# EAGLE design EKG_Modul_I (EAGLE 9.3.1)
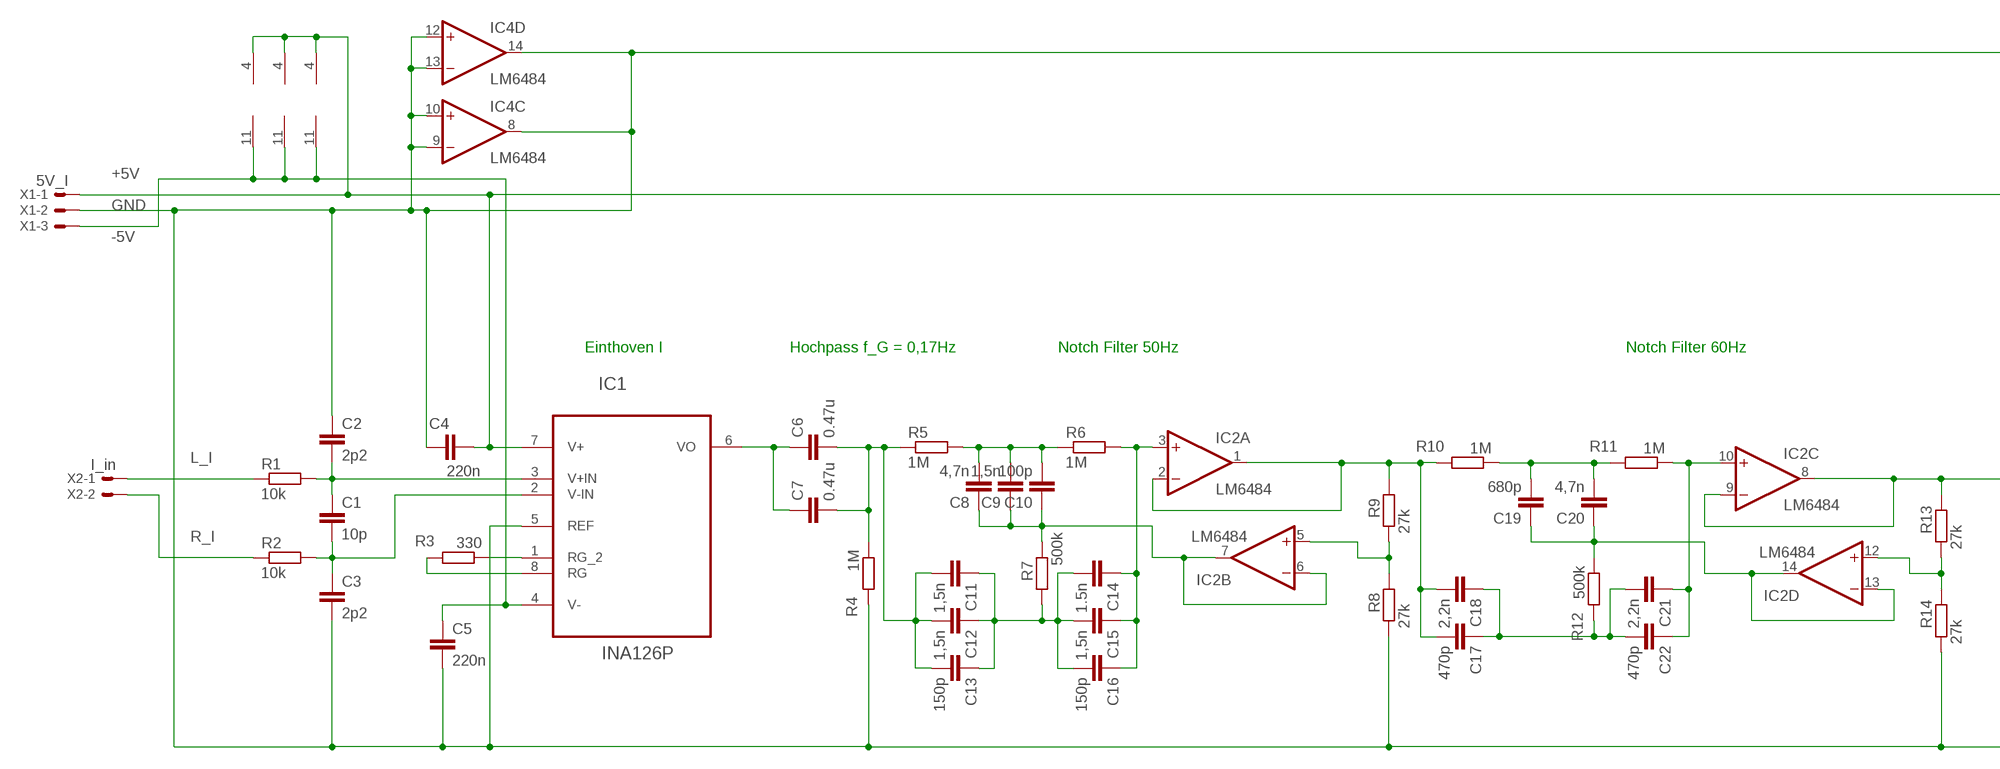
[diagram p0: schematic, sheet 1, part 1 of 2]
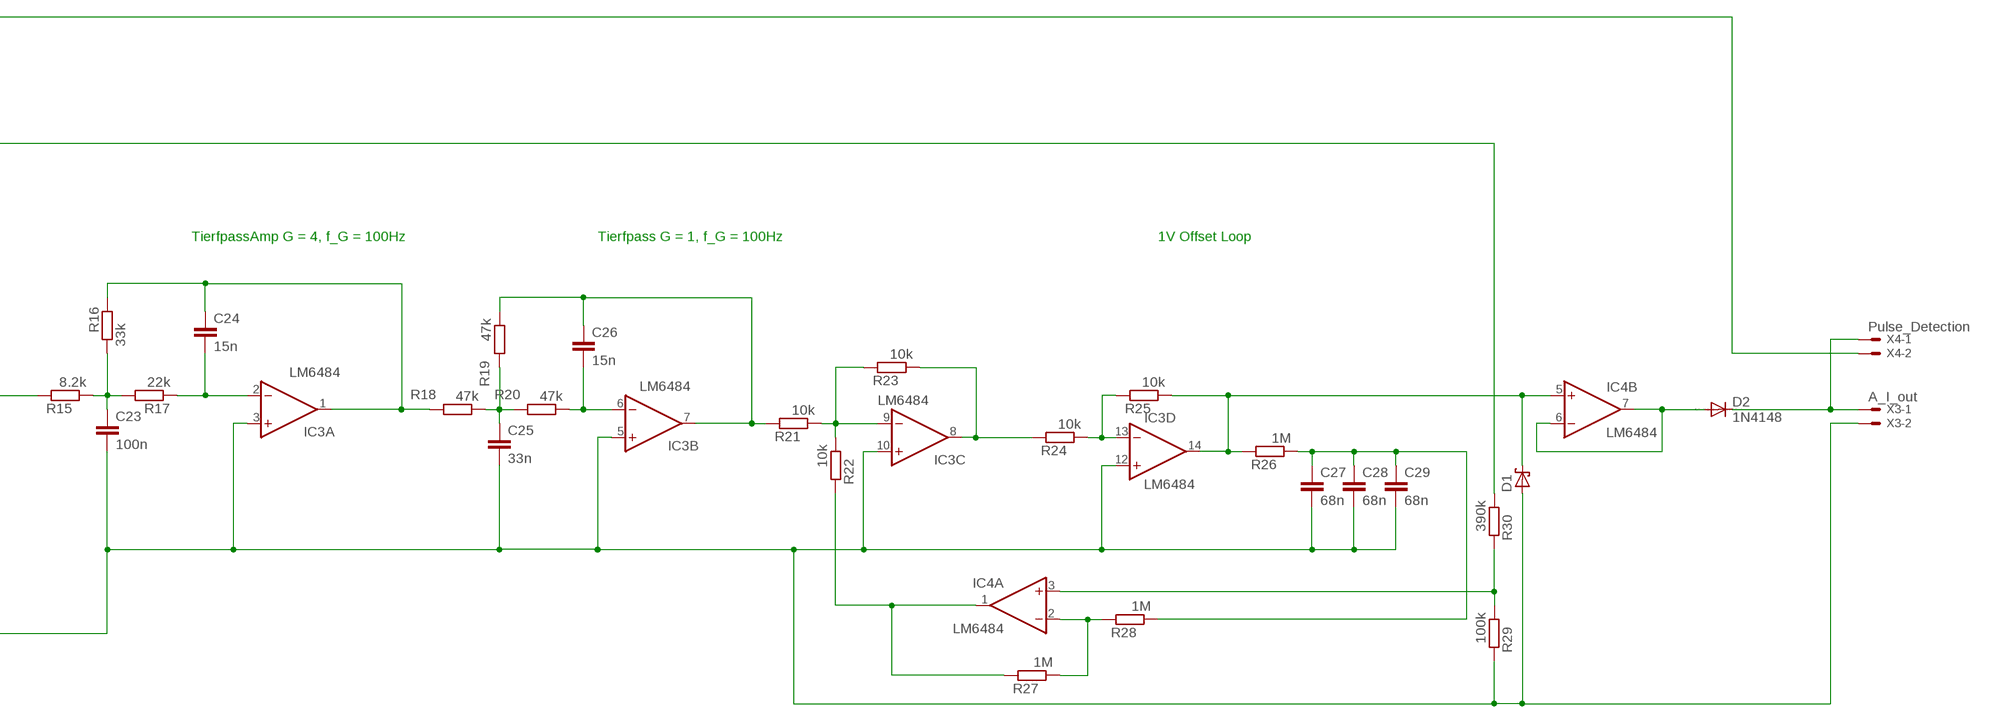
[diagram p1: schematic, sheet 1, part 2 of 2]

## Parts
C1  10p  C2.5/2  [C2.5-2]
C2  2p2  C2.5/2  [C2.5-2]
C3  2p2  C2.5/2  [C2.5-2]
C4  220n  C2.5/2  [C2.5-2]
C5  220n  C2.5/2  [C2.5-2]
C6  0.47u  C15/5  [C15B5]
C7  0.47u  C15/5  [C15B5]
C8  4,7n  C2.5/2  [C2.5-2]
C9  1,5n  C2.5/2  [C2.5-2]
C10  100p  C2.5/2  [C2.5-2]
C11  1,5n  C2.5/2  [C2.5-2]
C12  1,5n  C2.5/2  [C2.5-2]
C13  150p  C2.5/2  [C2.5-2]
C14  1.5n  C2.5/2  [C2.5-2]
C15  1,5n  C2.5/2  [C2.5-2]
C16  150p  C2.5/2  [C2.5-2]
C17  470p  C2.5/2  [C2.5-2]
C18  2,2n  C2.5/2  [C2.5-2]
C19  680p  C2.5/2  [C2.5-2]
C20  4,7n  C2.5/2  [C2.5-2]
C21  2,2n  C2.5/2  [C2.5-2]
C22  470p  C2.5/2  [C2.5-2]
C23  100n  C2.5/2  [C2.5-2]
C24  15n  C2.5/2  [C2.5-2]
C25  33n  C2.5/2  [C2.5-2]
C26  15n  C2.5/2  [C2.5-2]
C27  68n  C2.5/2  [C2.5-2]
C28  68n  C2.5/2  [C2.5-2]
C29  68n  C2.5/2  [C2.5-2]
D1  SCHOTTKY-DIODEDO35-7  [DO35-7]
D2  1N4148  1N4148DO35-7  [DO35-7]
IC1  INA126P  [DIP254P762X508-8]
IC2  LM6484  QUAD_OPAMPP  [DIL14]
IC3  LM6484  QUAD_OPAMPP  [DIL14]
IC4  LM6484  QUAD_OPAMPP  [DIL14]
R1  10k  R-EU_0207/7  [0207/7]
R2  10k  R-EU_0207/7  [0207/7]
R3  330  R-EU_0207/7  [0207/7]
R4  1M  R-EU_0207/7  [0207/7]
R5  1M  R-EU_0207/7  [0207/7]
R6  1M  R-EU_0207/7  [0207/7]
R7  500k  R-EU_0207/7  [0207/7]
R8  27k  R-EU_0207/7  [0207/7]
R9  27k  R-EU_0207/7  [0207/7]
R10  1M  R-EU_0207/7  [0207/7]
R11  1M  R-EU_0207/7  [0207/7]
R12  500k  R-EU_0207/7  [0207/7]
R13  27k  R-EU_0207/7  [0207/7]
R14  27k  R-EU_0207/7  [0207/7]
R15  8.2k  R-EU_0207/7  [0207/7]
R16  33k  R-EU_0207/7  [0207/7]
R17  22k  R-EU_0207/7  [0207/7]
R18  47k  R-EU_0207/7  [0207/7]
R19  47k  R-EU_0207/7  [0207/7]
R20  47k  R-EU_0207/7  [0207/7]
R21  10k  R-EU_0207/7  [0207/7]
R22  10k  R-EU_0207/7  [0207/7]
R23  10k  R-EU_0207/7  [0207/7]
R24  10k  R-EU_0207/7  [0207/7]
R25  10k  R-EU_0207/7  [0207/7]
R26  1M  R-EU_0207/7  [0207/7]
R27  1M  R-EU_0207/7  [0207/7]
R28  1M  R-EU_0207/7  [0207/7]
R29  100k  R-EU_0207/7  [0207/7]
R30  390k  R-EU_0207/7  [0207/7]
X1  5V_I  JST-XH-03-PIN-LONG-PAD  [JST-XH-03-PACKAGE-LONG-PAD]
X2  I_in  JST-XH-02-PIN-LONG-PAD  [JST-XH-02-PACKAGE-LONG-PAD]
X3  A_I_out  JST-XH-02-PIN-LONG-PAD  [JST-XH-02-PACKAGE-LONG-PAD]
X4  Pulse_Detection  JST-XH-02-PIN-LONG-PAD  [JST-XH-02-PACKAGE-LONG-PAD]

## Nets
+5V: C4.2 IC1.7(V+) IC2.4(P:V+) IC3.4(P:V+) IC4.4(P:V+) R30.1 X1.1
-5V: C5.1 IC1.4(V-) IC2.11(P:V-) IC3.11(P:V-) IC4.11(P:V-) X1.3
GND: C2.1 C3.2 C4.1 C5.2 C23.2 C25.2 C27.2 C28.2 C29.2 D1.A IC1.5(REF) IC3.3(A:+IN) IC3.5(B:+IN) IC3.10(C:+IN) IC3.12(D:+IN) IC4.8(C:OUT) IC4.9(C:-IN) IC4.10(C:+IN) IC4.12(D:+IN) IC4.13(D:-IN) IC4.14(D:OUT) R4.2 R8.1 R14.1 R29.2 X1.2 X3.2 X4.2
L_I: R1.1 X2.1
N$1: D2.A IC4.6(B:-IN) IC4.7(B:OUT)
N$2: D2.C X3.1 X4.1
N$3: C1.1 C2.2 IC1.3(V+IN) R1.2
N$4: C1.2 C3.1 IC1.2(V-IN) R2.2
N$5: IC1.1(RG_2) R3.1
N$6: IC1.8(RG) R3.2
N$7: C6.1 C7.1 IC1.6(VO)
N$8: C6.2 C7.2 C11.2 C12.2 C13.2 R4.1 R5.1
N$9: C17.2 C18.2 IC2.1(A:OUT) IC2.2(A:-IN) R9.2 R10.2
N$10: C8.2 C9.2 C10.2 R5.2 R6.1
N$11: C11.1 C12.1 C13.1 C14.2 C15.2 C16.2 R7.1
N$12: C14.1 C15.1 C16.1 IC2.3(A:+IN) R6.2
N$13: IC2.8(C:OUT) IC2.9(C:-IN) R13.2 R15.2
N$14: IC2.5(B:+IN) R8.2 R9.1
N$15: C24.1 IC3.1(A:OUT) R16.2 R18.2
N$16: C19.2 C20.2 R10.1 R11.2
N$17: C23.1 R15.1 R16.1 R17.2
N$18: C17.1 C18.1 C21.2 C22.2 R12.2
N$19: C21.1 C22.1 IC2.10(C:+IN) R11.1
N$20: C19.1 C20.1 IC2.13(D:-IN) IC2.14(D:OUT) R12.1
N$21: C24.2 IC3.2(A:-IN) R17.1
N$22: IC2.12(D:+IN) R13.1 R14.2
N$23: IC3.13(D:-IN) R24.1 R25.2
N$24: C26.2 IC3.6(B:-IN) R20.1
N$25: C25.1 R18.1 R19.2 R20.2
N$26: IC3.9(C:-IN) R21.1 R22.1 R23.2
N$27: C26.1 IC3.7(B:OUT) R19.1 R21.2
N$28: IC3.8(C:OUT) R23.1 R24.2
N$29: C8.1 C9.1 C10.1 IC2.6(B:-IN) IC2.7(B:OUT) R7.2
N$30: D1.C IC3.14(D:OUT) IC4.5(B:+IN) R25.1 R26.2
N$31: IC4.1(A:OUT) R22.2 R27.2
N$32: IC4.2(A:-IN) R27.1 R28.2
N$33: C27.1 C28.1 C29.1 R26.1 R28.1
N$34: IC4.3(A:+IN) R29.1 R30.2
R_I: R2.1 X2.2

## Notes on the sheet
- TierfpassAmp G = 4, f_G = 100Hz | Tierfpass G = 1, f_G = 100Hz | 1V Offset Loop
- Einthoven I | Hochpass f_G = 0,17Hz | Notch Filter 50Hz | Notch Filter 60Hz

## Library data of the parts
C1-C29 = capacitor-wima:C: CAPACITOR naming: grid - package width
D1 = adafruit:SCHOTTKY-DIODE: Schottky Diode
D2 = diode:1N4148: DIODE high speed (Philips)
IC1 = INA126P:INA126P: INSTRUMENTATION AMPLIFIER; AVAILABILITY: Unavailable; DESCRIPTION: 8pin Dip/Pkg Micropower Instrumentation Amplifier Single And Dual Versions; MF: Texas Instruments; MP: INA126P; PACKAGE: DIP-8 Texas Instruments; PRICE: None
IC2-IC4 = adafruit:QUAD_OPAMP: OP AMP Standard quad package
R1-R30 = rcl:R-EU_: RESISTOR, European symbol; SPICEPREFIX: R
X1 = Rembrandt Electronics - JST XH Connectors v1-0:JST-XH-03-PIN: JST XH Connector 2 Pin Wire to board connector. Pitch: 2,54 mm, (0.100") Number of pins: 3 Created by Rembrandt Electronics www.rembrandtelectronics.com
X2-X4 = Rembrandt Electronics - JST XH Connectors v1-0:JST-XH-02-PIN: JST XH Connector 2 Pin Wire to board connector. Pitch: 2,54 mm, (0.100") Number of pins: 2 Created by Rembrandt Electronics www.rembrandtelectronics.com

## Board
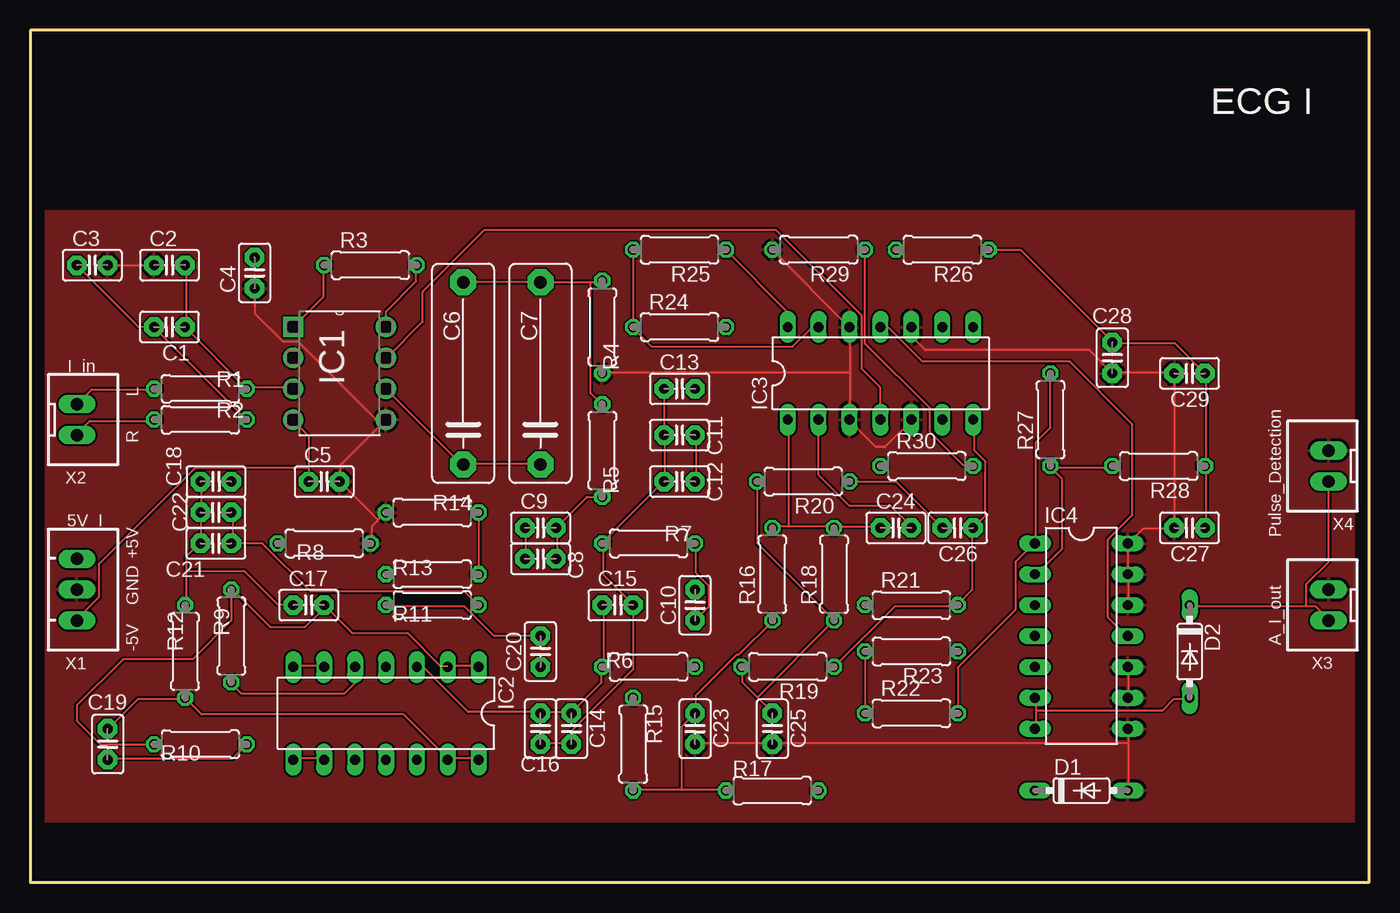
[diagram p2: board, top side]
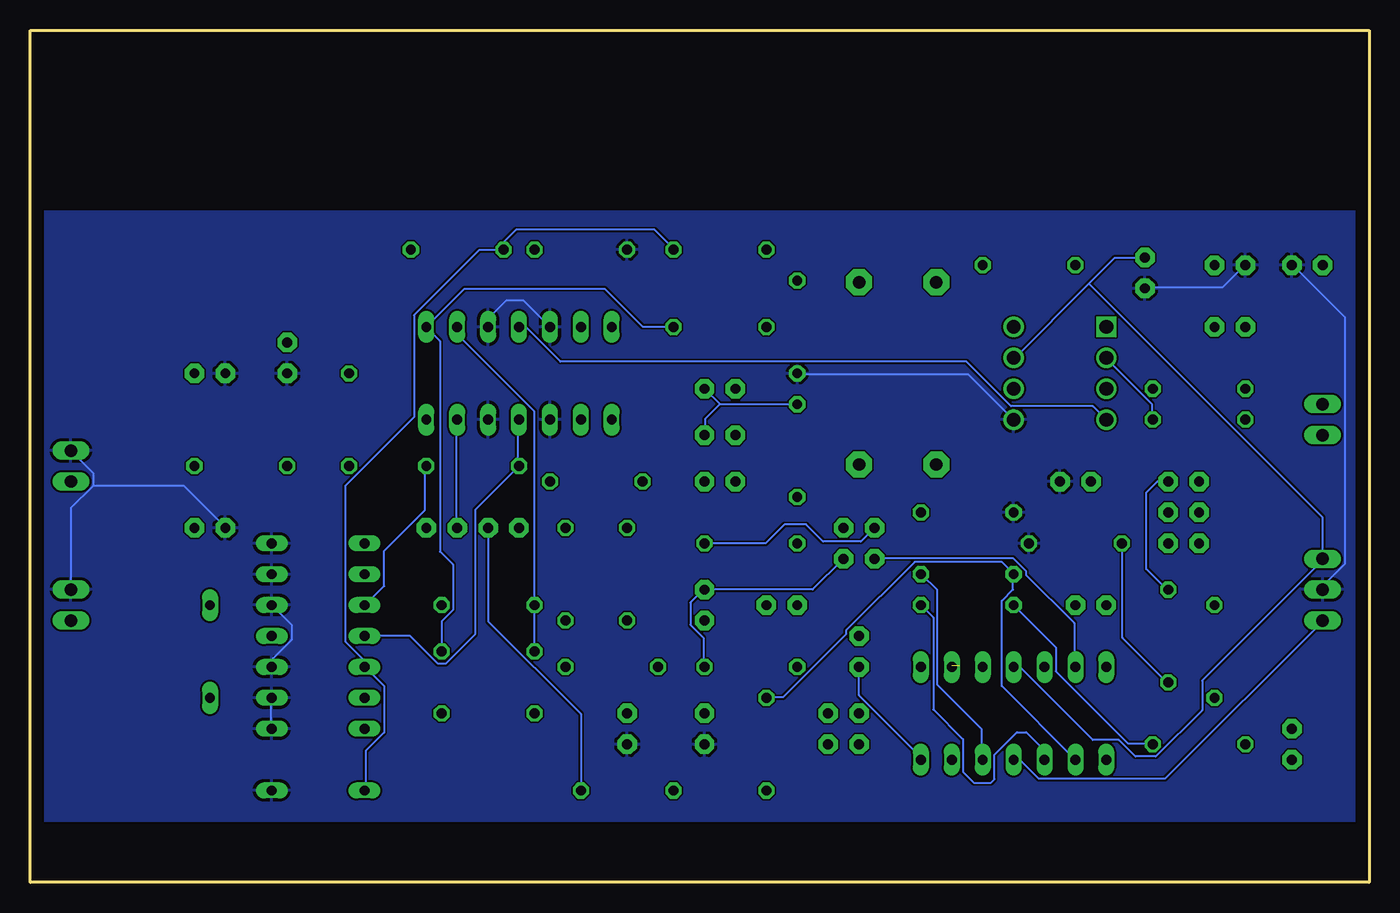
[diagram p3: board, bottom side, seen from below]

Size 110 x 70.01 mm. Coordinates in mm from the lower left corner, seen from the top.
Outline: 0,0 110,0 110,70.01 0,70.01 0,0
Copper layers (1*16): Top 0.035mm / dielectric 1.5mm / Bottom 0.035mm
Design rules "default": minimum track width 6mil, minimum drill 0.35mm, track to track 6mil, track to pad 6mil, pad to pad 6mil, via to via 6mil, smd to smd 6mil, copper to edge 40mil, drill to drill 6mil, minimum pad ring 10mil, minimum via ring 8mil, stop-mask expansion 4mil, vias tented up to drill 0mil, thermal gap 10mil

### Footprints (pad centres in the part's own frame; a part is rotated, then mirrored left to right if it is on the bottom)
C2.5-2 = drill 0.813 pad 1.6 octagon: 1 -1.27,0; 2 1.27,0
C15B5 = drill 1.016 pad 2.159 octagon: 1 -7.493,0; 2 7.493,0
DO35-7 = drill 0.813 long: A 3.81,0; C -3.81,0
DIP254P762X508-8 = drill 1.118 square: 1 -7.62,7.62 | drill 1.118: 2 -7.62,5.08; 3 -7.62,2.54; 4 -7.62,0; 5 0,0; 6 0,2.54; 7 0,5.08; 8 0,7.62
DIL14 = drill 0.813 long: 1 -7.62,-3.81; 2 -5.08,-3.81; 3 -2.54,-3.81; 4 0,-3.81; 5 2.54,-3.81; 6 5.08,-3.81; 7 7.62,-3.81; 8 7.62,3.81; 9 5.08,3.81; 10 2.54,3.81; 11 0,3.81; 12 -2.54,3.81; 13 -5.08,3.81; 14 -7.62,3.81
0207/7 = drill 0.813 octagon: 1 -3.81,0; 2 3.81,0
JST-XH-03-PACKAGE-LONG-PAD = drill 1.016 long: 1 -2.54,0; 2 0,0; 3 2.54,0
JST-XH-02-PACKAGE-LONG-PAD = drill 1.016 long: 1 -1.27,0; 2 1.27,0

### Placement (x,y rotation side)
C1  11.43,45.64 180 top
C2  11.43,50.72 0 top
C3  5.08,50.72 0 top
C4  18.41,50.08 90 top
C5  24.13,32.94 0 top
C6  35.56,41.83 90 top
C7  41.91,41.83 90 top
C8  41.91,26.59 0 top
C9  41.91,29.13 0 top
C10  54.61,22.78 90 top
C11  53.34,36.75 0 top
C12  53.34,32.94 0 top
C13  53.34,40.56 0 top
C14  44.45,12.62 270 top
C15  48.26,22.78 0 top
C16  41.91,12.62 270 top
C17  22.86,22.78 0 top
C18  15.24,32.94 0 top
C19  6.35,11.35 270 top
C20  41.91,18.97 90 top
C21  15.24,27.86 180 top
C22  15.24,30.4 180 top
C23  54.61,12.62 270 top
C24  71.12,29.13 0 top
C25  60.96,12.62 270 top
C26  76.2,29.13 180 top
C27  95.25,29.13 180 top
C28  88.9,43.1 270 top
C29  95.25,41.83 180 top
D1  86.36,7.54 0 top
D2  95.25,18.97 270 top
IC1  29.21,38.02 0 top
IC2  29.21,13.89 180 top
IC3  69.85,41.83 0 top
IC4  86.36,20.24 270 top
R1  13.97,40.56 0 top
R2  13.97,38.02 0 top
R3  27.94,50.72 0 top
R4  46.99,45.64 270 top
R5  46.99,35.48 270 top
R6  50.8,17.7 180 top
R7  50.8,27.86 0 top
R8  24.13,27.86 180 top
R9  16.51,20.24 90 top
R10  13.97,11.35 180 top
R11  33.02,22.78 180 top
R12  12.7,18.97 90 top
R13  33.02,25.32 180 top
R14  33.02,30.4 0 top
R15  49.53,11.35 90 top
R16  60.96,25.32 90 top
R17  60.96,7.54 180 top
R18  66.04,25.32 90 top
R19  62.23,17.7 180 top
R20  63.5,32.94 180 top
R21  72.39,22.78 0 top
R22  72.39,13.89 0 top
R23  72.39,18.97 180 top
R24  53.34,45.64 0 top
R25  53.34,51.99 180 top
R26  74.93,51.99 180 top
R27  83.82,38.02 90 top
R28  92.71,34.21 180 top
R29  64.77,51.99 180 top
R30  73.66,34.21 0 top
X1  3.81,24.05 270 top
X2  3.81,38.02 270 top
X3  106.68,22.78 90 top
X4  106.68,34.21 90 top

### Tracks (layer width: path | path; a pad name or v marks a point on that pad's centre or on a via)
+5V
  Top 0.152: IC3.4 69.8,38.07 69.8,40.71 68.28,42.23 68.28,46.6 61.24,53.64 37.34,53.64 32.23,48.53 32.23,46.07 29.26,43.1 IC1.7
  Bottom 0.152: IC3.4 69.95,37.92 69.95,34.26 R30.1 73.46,30.6 73.46,20.39 75.89,17.95 76.5,17.95 78.79,20.24 IC4.4 | 23.01,49.19 29.11,43.1 IC1.7 | 23.01,49.19 20.88,51.33 18.44,51.33 C4.2 | IC2.4 29.11,17.65 28.65,17.65 22.71,11.7 20.57,11.7 19.2,10.33 17.53,10.33 13.72,14.14 13.72,16.58 3.81,26.49 X1.1 3.81,29.99 23.01,49.19
-5V
  Top 0.152: IC3.11 69.95,45.54 70.56,45.54 73.3,42.79 85.39,42.79 90.55,37.64 90.55,30.17 88.54,28.16 88.54,21.76 90.07,20.24 IC4.11 | 22.86,34.11 22.86,36.7 21.64,37.92 IC1.4 | 22.86,34.11 C5.1 | 22.86,34.11 13.56,34.11 5.64,26.18 5.64,23.44 3.81,21.61 X1.3
  Bottom 0.152: IC2.11 29.11,10.03 28.65,10.03 27.13,8.5 16.76,8.5 3.81,21.46 X1.3 | IC1.4 22.71,39.14 29.41,39.14 33.07,42.79 66.45,42.79 69.19,45.54 69.8,45.54 IC3.11
GND
  Top 0.152: R14.1 28.65,29.84 | 28.65,29.84 28.04,29.23 28.04,27.86 R8.1 | 28.65,29.84 28.5,29.84 C5.2 25.45,33.04 25.45,34.26 28.8,37.61 | 28.8,37.61 IC1.5 29.11,37.92 | C3.2 C2.1 | 28.8,37.61 21.95,44.47 20.73,44.47 18.44,46.76 18.44,48.74 C4.1 | 60.96,11.4 54.71,11.4 C23.2 | IC4.9 90.22,15.21 90.22,17.65 IC4.10 | 90.22,11.4 90.22,12.62 IC4.8 | 90.22,11.4 90.22,7.59 D1.A | 90.22,11.4 60.96,11.4 | 60.96,11.4 C25.2 | IC3.5 72.39,37.92 70.23,35.76 69.49,35.76 67.31,37.94 IC3.3 67.36,38.07 67.36,41.88 | R29.2 60.96,51.94 67.21,45.69 IC3.12 67.36,45.54 67.36,41.88 | IC4.12 90.22,22.83 90.22,25.27 IC4.13 90.22,25.42 90.22,27.86 | 90.22,27.86 91.44,29.08 93.88,29.08 C27.2 94.03,29.23 94.03,41.73 C29.2 93.88,41.88 89,41.88 C28.2 87,43.73 73.53,43.73 72.39,44.88 IC3.10 | 90.22,27.86 IC4.14 | 67.36,41.88 47.09,41.88 R4.2
  Bottom 0.152: IC1.5 32.92,41.73 46.94,41.73 R4.2 | X1.2 3.81,24.35 1.98,26.18 1.98,46.45 6.25,50.72 C3.2 | C4.1 18.29,48.89 12.04,48.89 10.21,50.72 C2.1 | IC4.9 90.22,15.06 90.22,12.62 IC4.8 | IC3.12 69.52,47.85 70.87,47.85 72.39,46.32 IC3.10 | X3.2 106.68,30.75 104.85,32.58 | 104.85,32.58 104.85,33.65 X4.2 | 104.85,32.58 97.38,32.58 94.03,29.23 C27.2 | IC4.12 88.54,21.15 88.54,19.93 90.07,18.41 90.07,17.8 IC4.10
  pour Top: 0,5 109.86,5 109.86,55.16 0,55.16
  pour Bottom: 0,5 109.86,5 109.86,55.16 0,55.16
L_I
  Top 0.152: X2.1 5.03,40.51 10.06,40.51 R1.1
N$1
  Top 0.152: 82.6,14.14 82.6,15.06 IC4.6 | 82.6,14.14 82.6,12.62 IC4.7 | 82.6,14.14 93.04,14.14 93.95,15.06 95.25,15.06 D2.A
N$2
  Top 0.152: 104.85,22.68 105.61,22.68 106.68,21.61 X3.1 | 104.85,22.68 95.25,22.68 D2.C | X4.1 106.68,26.33 104.85,24.51 104.85,22.68
N$3
  Top 0.152: IC1.3 21.49,40.66 17.83,40.66 R1.2 C1.1 12.8,45.69 12.8,50.72 C2.2
N$4
  Top 0.152: C3.1 8.84,45.69 10.06,45.69 C1.2 10.21,45.54 17.68,38.07 R2.2
  Bottom 0.152: R2.2 17.83,38.07 17.83,39.29 21.64,43.1 IC1.2
N$5
  Top 0.152: IC1.1 24.08,48.13 24.08,50.72 R3.1
N$6
  Top 0.152: IC1.8 29.21,46.91 31.7,49.4 31.7,50.72 R3.2
N$7
  Top 0.152: IC1.6 35.51,34.26 C6.1 35.66,34.41 41.91,34.41 C7.1
N$8
  Top 0.152: 41.91,49.35 46.02,49.35 | 46.02,49.35 46.94,49.35 R4.1 | 41.91,49.35 35.66,49.35 C6.2 | 41.91,49.35 C7.2 | C12.2 54.71,33.04 54.71,36.7 C11.2 | 46.02,49.35 46.02,40.2 46.94,39.29 R5.1
  Bottom 0.152: 53.34,39.29 R5.1 | C13.2 53.34,39.29 | 53.34,39.29 54.56,38.07 54.56,36.85 C11.2
N$9  (1 unrouted)
  Top 0.152: IC2.1 36.73,17.8 33.68,17.8 30.99,20.49 26.42,20.49 C17.2 24.13,22.52 22.58,20.98 19.68,20.98 16.61,24.05 R9.2 16.51,21.51 13.34,18.33 7.62,18.33 3.81,14.52 3.81,13.25 5.71,11.35 R10.2 10.06,11.4 | 34.29,17.8 IC2.2
  Bottom 0.152: C18.2 17.4,32.94 18.31,32.02 18.31,25.75 16.61,24.05 R9.2
N$10
  Top 0.152: R5.2 45.72,31.67 C9.2 43.28,29.08 43.28,26.64 C8.2
  Bottom 0.152: R6.1 54.71,17.8 54.71,20.09 55.78,21.15 55.78,22.98 54.71,24.05 C10.2 45.72,24.05 C8.2
N$11
  Top 0.152: C13.1 52.12,40.51 52.12,36.85 C11.1 52.12,36.7 52.12,33.04 C12.1 51.97,32.89 46.94,27.86 R7.1 47.09,27.86 47.09,25.27 49.53,22.83 C15.2 49.53,17.5 44.5,12.47 44.5,11.4 C14.2 44.35,11.4 41.91,11.4 C16.2
N$12
  Top 0.152: C15.1 47.09,22.68 47.09,17.8 R6.2 46.94,17.65 46.94,16.43 44.5,13.99 C14.1 44.35,13.99 41.91,13.99 | 41.91,13.99 35.97,13.99 32.31,17.65 31.85,17.65 IC2.3 | 41.91,13.99 C16.1
N$13
  Top 0.152: IC2.8 21.64,10.18 24.08,10.18 IC2.9
  Bottom 0.152: IC2.9 30.18,16.12 30.18,23.13 29.26,24.05 29.26,25.27 R13.2 29.26,25.42 30.18,26.33 37.34,26.33 42.98,20.7 42.98,20.39 48.16,15.21 49.53,15.21 R15.2
N$14
  Top 0.152: R9.1 16.51,16.35 17.37,15.49 25.78,15.49 26.67,16.38 IC2.5
  Bottom 0.152: R8.2 20.27,27.86 20.27,20.09 16.61,16.43 R9.1
N$15
  Top 0.152: 62.33,29.23 65.99,29.23 R18.2 66.14,29.23 69.8,29.23 C24.1 | 62.33,29.23 60.96,29.23 R16.2 | 62.33,29.23 62.33,37.92 IC3.1
N$16
  Top 0.152: R10.1 16.61,10.18 6.4,10.18 C19.2 | C20.2 38.1,20.24 35.66,22.68 29.26,22.68 R11.2
  Bottom 0.152: R11.2 25.76,19.32 25.76,17.34 19.81,11.4 17.83,11.4 R10.1
N$17
  Top 0.152: 53.49,7.59 57.15,7.59 R17.2 | 53.49,7.59 49.53,7.59 R15.1 | R16.1 60.96,21.46 58.22,18.71 58.06,18.71 54.71,15.36 54.71,13.99 C23.1 53.49,12.77 53.49,7.59
N$18
  Top 0.152: C18.1 14.02,32.89 14.02,30.45 C22.2 14.02,30.3 14.02,27.86 C21.2 13.87,27.86 12.8,26.79 12.8,25.6 | 12.8,25.6 12.8,22.83 R12.2 | 12.8,25.6 17.55,25.6 20.32,22.83 21.49,22.83 C17.1
N$19
  Top 0.152: 16.61,27.86 16.61,30.3 C22.1 | 16.61,27.86 19.05,27.86 23.01,23.9 35.66,23.9 36.73,22.83 R11.1 | 16.61,27.86 C21.1
  Bottom 0.152: IC2.10 26.67,10.84 28.17,12.34 28.93,12.34 30.79,10.48 30.79,8.48 31.09,8.17 32.46,8.17 33.38,9.09 33.38,11.75 35.81,14.19 35.81,21.76 R11.1
N$20
  Top 0.152: C19.1 6.4,12.62 8.84,15.06 12.65,15.06 R12.1 14.07,13.79 30.68,13.79 34.29,10.18 | 34.29,10.18 36.73,10.18 IC2.14 | 34.29,10.18 IC2.13
  Bottom 0.152: C20.1 41.91,15.36 36.73,10.18 IC2.14
N$21
  Top 0.152: IC3.2 64.77,33.47 67.31,30.93 70.69,30.93 72.39,29.23 C24.2
  Bottom 0.152: R17.1 64.77,13.84 72.39,21.46 C24.2
N$22
  Top 0.152: R14.2 36.88,30.3 36.88,25.42 R13.1
  Bottom 0.152: IC2.12 31.85,10.18 31.85,12.59 35.51,16.25 35.51,24.05 36.73,25.27 R13.1
N$23
  Top 0.152: R25.2 R24.1 49.53,45.54 51.05,44.01 62.64,44.01 64.16,45.54 64.77,45.54 IC3.13
N$24
  Top 0.152: C26.2 71.17,32.89 67.36,32.89 R20.1
  Bottom 0.152: IC3.6 74.98,37.92 74.98,29.23 C26.2
N$25
  Top 0.152: 59.74,15.21 60.96,13.99 C25.1 | 59.74,15.21 58.52,16.43 58.52,17.65 R19.2 | 59.74,15.21 R18.1 65.99,21.61 59.74,27.86 59.74,32.89 R20.2
N$26
  Top 0.152: R23.2 R22.1
  Bottom 0.152: R23.2 R21.1 68.58,38.68 74.83,44.93 74.83,45.54 IC3.9
N$27
  Top 0.152: IC3.7 77.57,37.92 77.57,35.48 78.49,34.56 78.49,30.14 C26.1 77.42,29.08 77.42,24.05 76.2,22.83 R21.2 76.2,22.68 71.02,22.68 R19.1
N$28
  Bottom 0.152: R24.2 57.15,45.69 59.72,45.69 62.81,48.79 74.32,48.79 IC3.8 77.42,45.54 76.35,44.47 76.35,27.17 75.29,26.11 75.29,22.37 76.2,21.46 R23.1
N$29
  Top 0.152: C10.1 55.78,22.68 55.78,24.35 54.71,25.42 54.71,27.86 R7.2 | IC2.7 21.64,17.8 24.08,17.8 IC2.6 | C8.1 40.69,26.64 40.69,29.08 C9.1
  Bottom 0.152: IC2.6 24.23,17.8 24.23,21.31 28.19,25.27 28.19,25.57 29.26,26.64 40.54,26.64 C8.1 | R7.2 49.58,27.86 48.03,29.41 46.25,29.41 44.86,28.01 41.76,28.01 C9.1
N$30
  Top 0.152: IC3.14 62.18,45.69 62.18,46.91 57.15,51.94 R25.1
  Bottom 0.152: D1.C 82.45,7.59 82.45,10.79 80.92,12.31 80.92,16.12 82.45,17.65 IC4.5 82.6,17.8 82.6,18.26 84.12,19.78 84.12,32.58 78.49,38.22 78.49,46.6 73.15,51.94 71.17,51.94 R26.2 71.12,52.62 70.1,53.64 58.7,53.64 57.15,52.09 R25.1
N$31
  Top 0.152: R22.2 76.2,17.65 80.92,22.37 80.92,26.33 82.45,27.86 IC4.1 82.6,27.86 82.6,36.16 83.82,37.38 R27.2
N$32
  Top 0.152: IC4.2 82.68,25.32 84.76,27.4 84.76,33.17 84.12,33.8 | 84.12,33.8 83.82,34.11 R27.1 84.12,33.8 | 84.12,33.8 84.43,34.11 88.85,34.11 R28.2
N$33
  Top 0.152: C27.1 96.62,29.23 96.62,34.11 R28.1 96.62,34.26 96.62,41.73 C29.1 94.03,44.32 89,44.32 C28.1 88.85,44.47 81.38,51.94 78.79,51.94 R26.1
N$34
  Top 0.152: R29.1 68.58,44.29 73.91,38.96 73.91,37 76.66,34.26 77.42,34.26 R30.2
  Bottom 0.152: R30.2 77.57,34.11 77.57,30.6 80.92,27.25 80.92,24.35 82.45,22.83 IC4.3
R_I
  Top 0.152: R2.1 10.06,37.92 4.88,37.92 3.81,36.85 X2.2

### Text on the board
tNames: ECG I | L | R | +5V | GND | -5V